# Altium schematic sheet TK520_GDT-Trafo.SchDoc
size A4
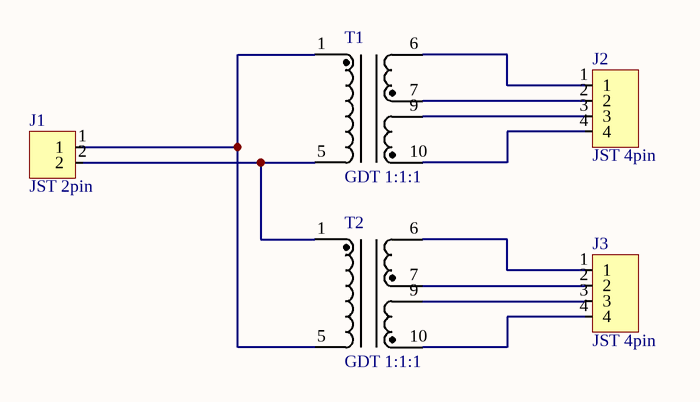
[diagram p0: TK520_GDT-Trafo.SchDoc]

## Parts
J1  JST 2pin  [JST 2pin]
J2  JST 4pin  [JST 4pin]
J3  JST 4pin  [JST 4pin]
T1  GDT 1:1:1  [SD250-3]
T2  GDT 1:1:1  [SD250-3]

## Nets
NetJ1_1: J1.1 T1.1 T2.5
NetJ1_2: J1.2 T1.5 T2.1
NetJ2_1: J2.1 T1.6
NetJ2_2: J2.2 T1.7
NetJ2_3: J2.3 T1.9
NetJ2_4: J2.4 T1.10
NetJ3_1: J3.1 T2.6
NetJ3_2: J3.2 T2.7
NetJ3_3: J3.3 T2.9
NetJ3_4: J3.4 T2.10